# Altium schematic sheet POWER.SchDoc
size A; SheetNumber: 4; SheetTotal: 4; SPICEModelCacheYKRLJLQR: <root> / <DocumentId>YKRLJLQR</DocumentId> / </root>
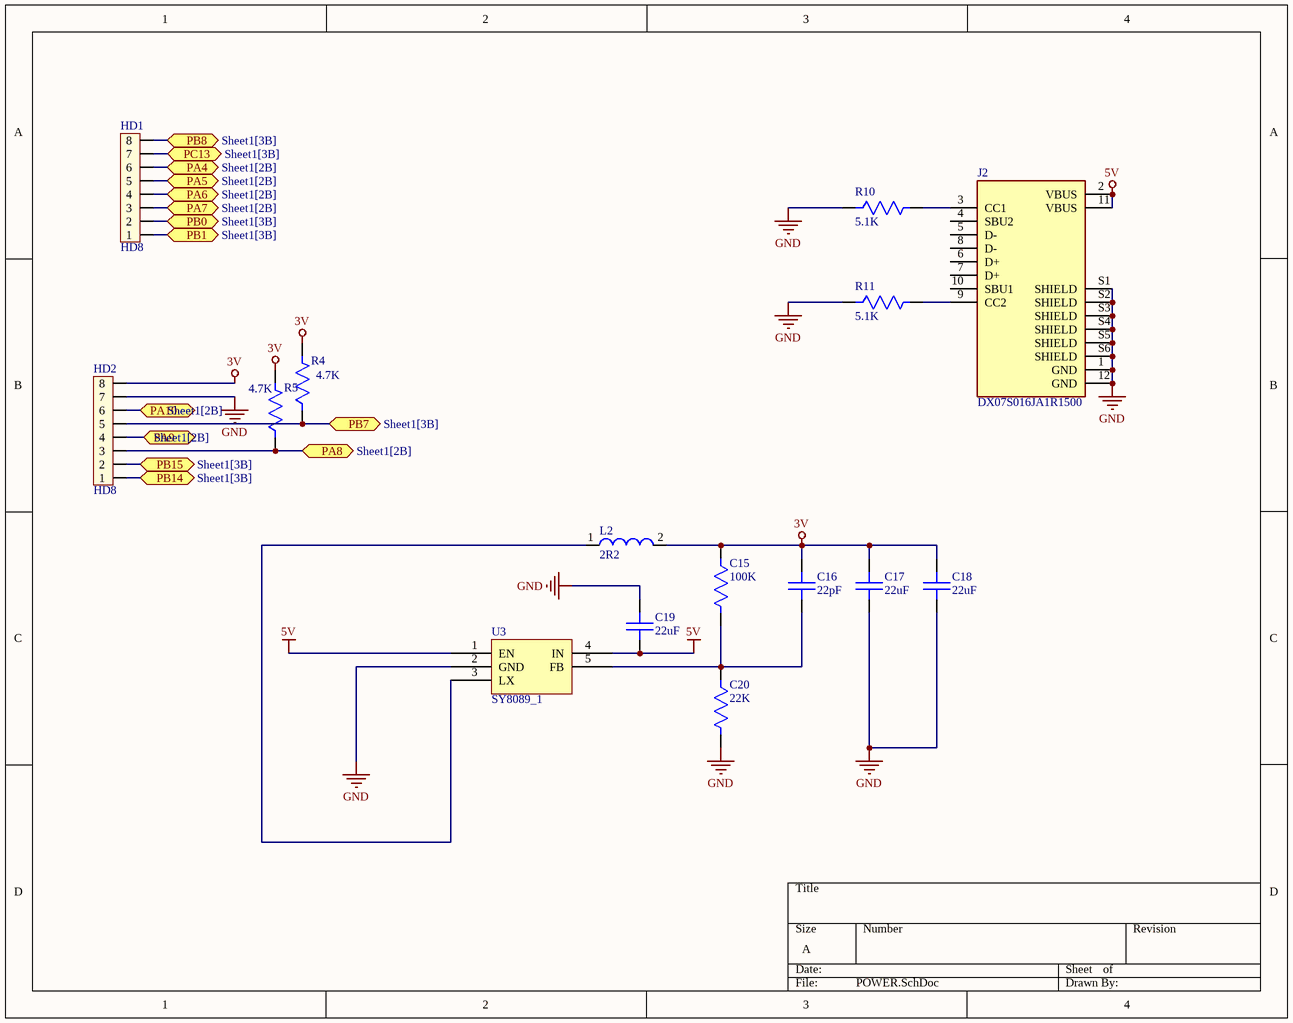
[diagram p0: POWER.SchDoc]

## Parts
C15  100K  [R0603]
C16  22pF  [C0603]
C17  22uF  [C0603]
C18  22uF  [C0603]
C19  22uF  [C0603]
C20  22K  [R0603]
HD1  HD8  [Header_8]
HD2  HD8  [Header_8]
J2  DX07S016JA1R1500  [JAE_DX07S016JA1R1500]
L2  2R2  [L0630]
R4  4.7K  [R0603]
R5  4.7K  [R0603]
R10  5.1K  [R0603]
R11  5.1K  [R0603]
U3  SY8089_1  [SOT23-5]

## Ports
PA4 (bidir, see Sheet1[2B]), PA5 (bidir, see Sheet1[2B]), PA6 (bidir, see Sheet1[2B]), PA7 (bidir, see Sheet1[2B]), PA8 (bidir, see Sheet1[2B]), PA9 (bidir, see Sheet1[2B]), PA10 (bidir, see Sheet1[2B]), PB0 (bidir, see Sheet1[3B]), PB1 (bidir, see Sheet1[3B]), PB7 (bidir, see Sheet1[3B]), PB8 (bidir, see Sheet1[3B]), PB14 (bidir, see Sheet1[3B]), PB15 (bidir, see Sheet1[3B]), PC13 (bidir, see Sheet1[3B])

## Nets
3V: C15.1 C16.2 C17.2 C18.2 HD2.8 L2.2 R4.2 R5.2
5V: C19.2 J2.2(VBUS) J2.11(VBUS) U3.1(EN) U3.4(IN)
GND: C17.1 C18.1 C19.1 C20.2 HD2.7 J2.1(GND) J2.12(GND) J2.S1(SHIELD) J2.S2(SHIELD) J2.S3(SHIELD) J2.S4(SHIELD) J2.S5(SHIELD) J2.S6(SHIELD) R10.1 R11.1 U3.2(GND)
PA4: HD1.6 ; port PA4
PA5: HD1.5 ; port PA5
PA6: HD1.4 ; port PA6
PA7: HD1.3 ; port PA7
PA8: HD2.3 R5.1 ; port PA8
PA9: HD2.4 ; port PA9
PA10: HD2.6 ; port PA10
PB0: HD1.2 ; port PB0
PB1: HD1.1 ; port PB1
PB7: HD2.5 R4.1 ; port PB7
PB8: HD1.8 ; port PB8
PB14: HD2.1 ; port PB14
PB15: HD2.2 ; port PB15
PC13: HD1.7 ; port PC13
NetC15_2: C15.2 C16.1 C20.1 U3.5(FB)
NetJ2_3: J2.3(CC1) R10.2
NetJ2_9: J2.9(CC2) R11.2
NetL2_1: L2.1 U3.3(LX)

Not connected (* = marked no-connect by the designer): J2 4(SBU2) 5(D-) 6(D+) 7(D+) 8(D-) 10(SBU1)

## Library data of the parts
C15 C20 R4 R5 R10 R11 = Resistor 0603: SMD Resistor 0603; Manufacturer: Yageo; Manufacturer Part Number: RC0603FR-071KL; Power Rating: 100mW; Tolerance: 1%; Temperature Coefficient: 100ppm/°C; Voltage Rating: 50V; Supplier: Digi-Key; Supplier Part Number: 311-1.00KHRDKR-ND; RoHS: Yes; Category: Chip SMD Resistors; Stock: 18662657; Pricing: 1=0.1, 10=0.018, 50=0.0106, 100=0.0088, 500=0.00592, 1000=0.00505 (USD); Case/Package: 0603; Case Code (Imperial): 0603; Case Code (Metric): 1608; Contact Plating: Tin,Matte; Min Operating Temperature: -55°C; Max Operating Temperature: 155°C; Packaging: Tape and Reel; Resistor Type: Thick Film; Termination: SMD/SMT; Features: Moisture Resistant; Series: RC; Max Power Dissipation: 100mW; Number of Terminations: 2; Resistance Tolerance: 1%; Construction: Rectangular; Technology: THICK FILM; Length: 1.6mm; Height: 0.45mm; Depth: 0.8mm; Reach SVHC Compliant: No; Military Standard: Not; Lead Free: 5697LeadFree; RoHS Compliant: Yes
C16-C19 = Capacitor 0603
HD1 HD2 = Header8: Header 8; Creat by: VanDungEvn@Gmail.com
J2 = DX07S016JA1R1500: USB-C (USB TYPE-C) USB 2.0 Receptacle Connector 24 (16+8 Dummy) Position Surface Mount, Right Angle; Through Hole; Package: None; Value: *; Price: None; MP: DX07S016JA1R1500; Availability: Unavailable
L2 = Inductor 0630: HIGH POWER INDUCTOR 1040; MF: Wurth Electronics; MP: 74437368047; Value: *; Price: None; Package: Nonstandard Wurth Electronics; SnapEDA_Link: https://www.snapeda.com/parts/74437368047/Wurth%20Electronics%20Inc./view-part/286863/?ref=snap; Availability: Unavailable